# EAGLE design SSv3_outputAmp (EAGLE 7.7.0)
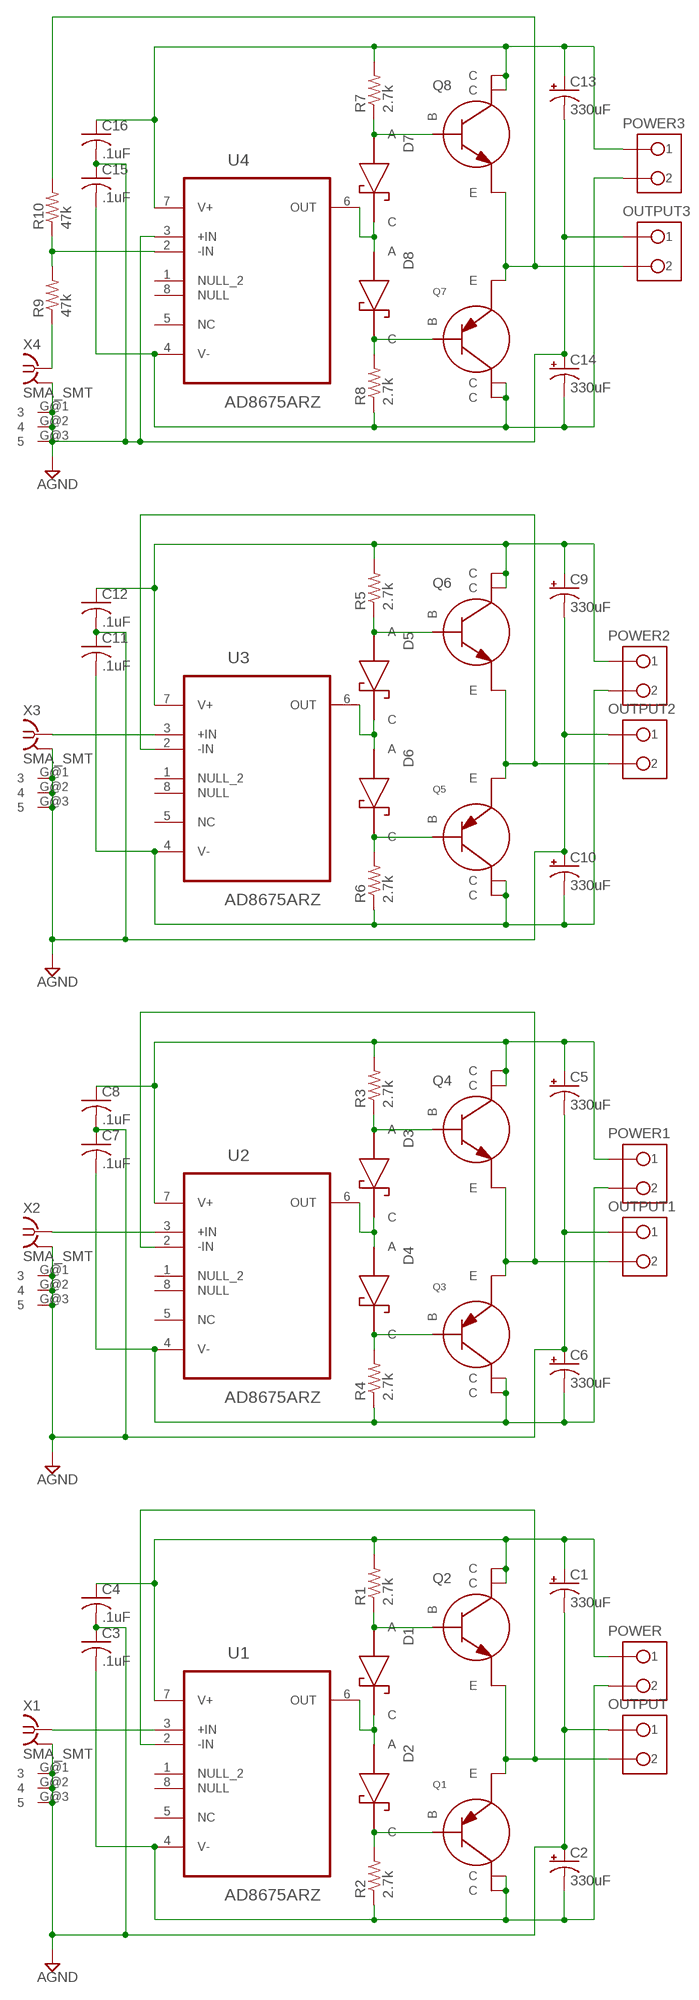
[diagram p0: schematic, sheet 1]

## Parts
C1  330uF  CPOL-USE3.5-8  [E3,5-8]
C2  330uF  CPOL-USE3.5-8  [E3,5-8]
C3  .1uF  C-USC0603  [C0603]
C4  .1uF  C-USC0603  [C0603]
C5  330uF  CPOL-USE3.5-8  [E3,5-8]
C6  330uF  CPOL-USE3.5-8  [E3,5-8]
C7  .1uF  C-USC0603  [C0603]
C8  .1uF  C-USC0603  [C0603]
C9  330uF  CPOL-USE3.5-8  [E3,5-8]
C10  330uF  CPOL-USE3.5-8  [E3,5-8]
C11  .1uF  C-USC0603  [C0603]
C12  .1uF  C-USC0603  [C0603]
C13  330uF  CPOL-USE3.5-8  [E3,5-8]
C14  330uF  CPOL-USE3.5-8  [E3,5-8]
C15  .1uF  C-USC0603  [C0603]
C16  .1uF  C-USC0603  [C0603]
D1  1N5819SOD123  [SOD-123]
D2  1N5819SOD123  [SOD-123]
D3  1N5819SOD123  [SOD-123]
D4  1N5819SOD123  [SOD-123]
D5  1N5819SOD123  [SOD-123]
D6  1N5819SOD123  [SOD-123]
D7  1N5819SOD123  [SOD-123]
D8  1N5819SOD123  [SOD-123]
OUTPUT  OST-2P-SCREW-TERMINAL  [OST-2P-SCREW-TERMINAL]
OUTPUT1  OST-2P-SCREW-TERMINAL  [OST-2P-SCREW-TERMINAL]
OUTPUT2  OST-2P-SCREW-TERMINAL  [OST-2P-SCREW-TERMINAL]
OUTPUT3  OST-2P-SCREW-TERMINAL  [OST-2P-SCREW-TERMINAL]
POWER  OST-2P-SCREW-TERMINAL  [OST-2P-SCREW-TERMINAL]
POWER1  OST-2P-SCREW-TERMINAL  [OST-2P-SCREW-TERMINAL]
POWER2  OST-2P-SCREW-TERMINAL  [OST-2P-SCREW-TERMINAL]
POWER3  OST-2P-SCREW-TERMINAL  [OST-2P-SCREW-TERMINAL]
Q1  NJT4030PSOT-223  [SOT223]
Q2  NJT4031NSOT-223  [SOT223]
Q3  NJT4030PSOT-223  [SOT223]
Q4  NJT4031NSOT-223  [SOT223]
Q5  NJT4030PSOT-223  [SOT223]
Q6  NJT4031NSOT-223  [SOT223]
Q7  NJT4030PSOT-223  [SOT223]
Q8  NJT4031NSOT-223  [SOT223]
R1  2.7k  R-US_R0603  [R0603]
R2  2.7k  R-US_R0603  [R0603]
R3  2.7k  R-US_R0603  [R0603]
R4  2.7k  R-US_R0603  [R0603]
R5  2.7k  R-US_R0603  [R0603]
R6  2.7k  R-US_R0603  [R0603]
R7  2.7k  R-US_R0603  [R0603]
R8  2.7k  R-US_R0603  [R0603]
R9  47k  R-US_R0603  [R0603]
R10  47k  R-US_R0603  [R0603]
U1  AD8675ARZ  [SOIC127P600X175-8N]
U2  AD8675ARZ  [SOIC127P600X175-8N]
U3  AD8675ARZ  [SOIC127P600X175-8N]
U4  AD8675ARZ  [SOIC127P600X175-8N]
X1  SMA_SMT  [SIDE_MOUNTSMA]
X2  SMA_SMT  [SIDE_MOUNTSMA]
X3  SMA_SMT  [SIDE_MOUNTSMA]
X4  SMA_SMT  [SIDE_MOUNTSMA]

## Nets
+12V: C1.+ C4.1 C5.+ C8.1 C9.+ C12.1 C13.+ C16.1 POWER1.P$1 POWER2.P$1 POWER3.P$1 POWER.P$1 Q2.2(C) Q2.4(C) Q4.2(C) Q4.4(C) Q6.2(C) Q6.4(C) Q8.2(C) Q8.4(C) R1.2 R3.2 R5.2 R7.2 U1.7(V+) U2.7(V+) U3.7(V+) U4.7(V+)
-12V: C2.- C3.2 C6.- C7.2 C10.- C11.2 C14.- C15.2 POWER1.P$2 POWER2.P$2 POWER3.P$2 POWER.P$2 Q1.2(C) Q1.4(C) Q3.2(C) Q3.4(C) Q5.2(C) Q5.4(C) Q7.2(C) Q7.4(C) R2.1 R4.1 R6.1 R8.1 U1.4(V-) U2.4(V-) U3.4(V-) U4.4(V-)
AGND: C1.- C2.+ C3.1 C4.2 C5.- C6.+ C7.1 C8.2 C9.- C10.+ C11.1 C12.2 C13.- C14.+ C15.1 C16.2 OUTPUT1.P$1 OUTPUT2.P$1 OUTPUT3.P$1 OUTPUT.P$1 U4.3(+IN) X1.G@1 X1.G@2 X1.G@3 X1.G@4 X2.G@1 X2.G@2 X2.G@3 X2.G@4 X3.G@1 X3.G@2 X3.G@3 X3.G@4 X4.G@1 X4.G@2 X4.G@3 X4.G@4
N$1: D1.C D2.A U1.6(OUT)
N$2: D1.A Q2.1(B) R1.1
N$3: D2.C Q1.1(B) R2.2
N$4: D3.C D4.A U2.6(OUT)
N$5: D3.A Q4.1(B) R3.1
N$6: D4.C Q3.1(B) R4.2
N$7: U1.3(+IN) X1.1
N$8: U2.3(+IN) X2.1
N$9: D5.C D6.A U3.6(OUT)
N$10: D5.A Q6.1(B) R5.1
N$11: D6.C Q5.1(B) R6.2
N$12: U3.3(+IN) X3.1
N$13: D7.C D8.A U4.6(OUT)
N$14: D7.A Q8.1(B) R7.1
N$15: D8.C Q7.1(B) R8.2
N$16: R9.1 X4.1
N$18: R9.2 R10.1 U4.2(-IN)
VOUT: OUTPUT.P$2 Q1.3(E) Q2.3(E) U1.2(-IN)
VOUT1: OUTPUT1.P$2 Q3.3(E) Q4.3(E) U2.2(-IN)
VOUT2: OUTPUT2.P$2 Q5.3(E) Q6.3(E) U3.2(-IN)
VOUT3: OUTPUT3.P$2 Q7.3(E) Q8.3(E) R10.2
Unconnected: U1.1(NULL_2) U1.5(NC) U1.8(NULL) U2.1(NULL_2) U2.5(NC) U2.8(NULL) U3.1(NULL_2) U3.5(NC) U3.8(NULL) U4.1(NULL_2) U4.5(NC) U4.8(NULL)

## Library data of the parts
C1 C2 C5 C6 C9 C10 C13 C14 = rcl:CPOL-US: POLARIZED CAPACITOR, American symbol
C3 C4 C7 C8 C11 C12 C15 C16 = rcl:C-US: CAPACITOR, American symbol
D1-D8 = SSv3_1:1N5819
OUTPUT OUTPUT1-OUTPUT3 POWER POWER1-POWER3 = SSv3_1:OST-2P-SCREW-TERMINAL
Q1 Q3 Q5 Q7 = SSv3_1:NJT4030P
Q2 Q4 Q6 Q8 = SSv3_1:NJT4031N
R1-R10 = resistor:R-US_: RESISTOR, American symbol
U1-U4 = Analog Devices_By_element14_Batch_1:AD8675ARZ: Rail-to-Rail Output Op Amp; MPN: AD8675ARZ; OC_FARNELL: 1389164; OC_NEWARK: 84K9788; PACKAGE: SOIC-8; SUPPLIER: Analog Devices
X1-X4 = SSv3_1:SMA_SMT: SMA 50 Ohm End Launch Jack Receptacle - Round Contact

## Board
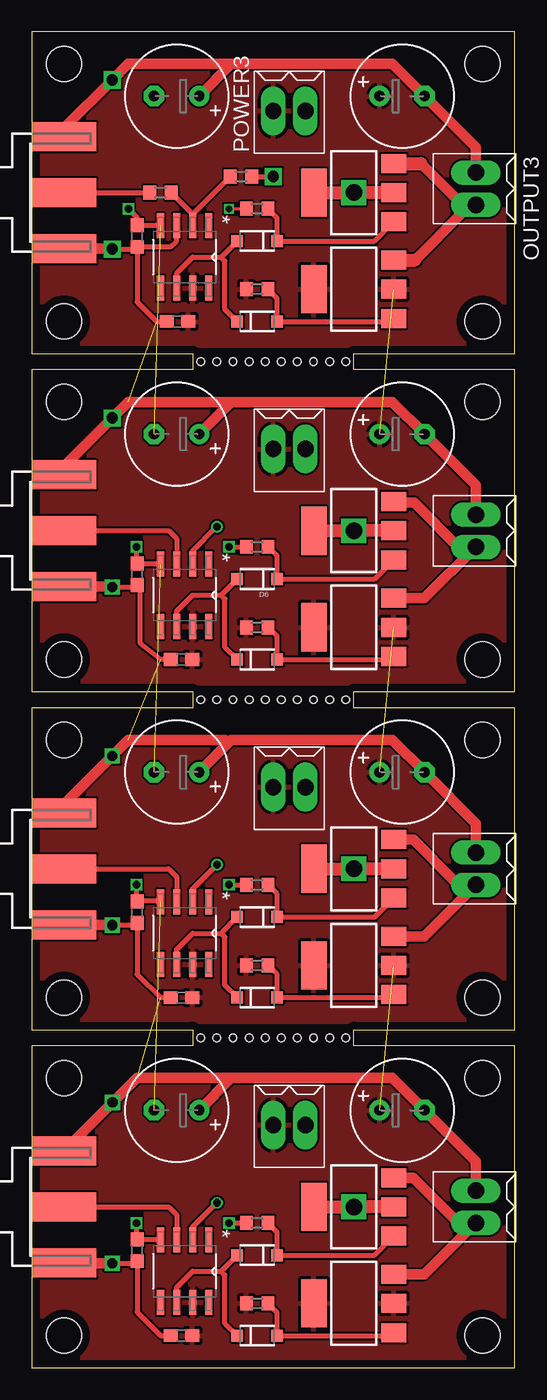
[diagram p1: board, top side]
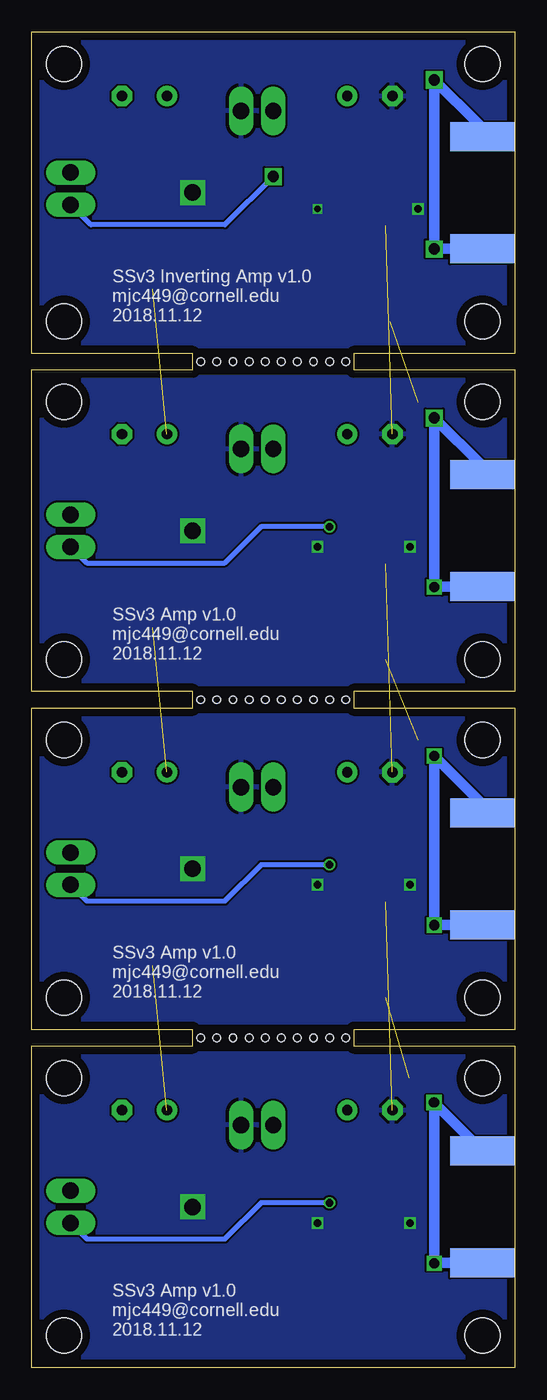
[diagram p2: board, bottom side, seen from below]

Size 38.1 x 105.41 mm. Coordinates in mm from the lower left corner, seen from the top.
Outline: 0,0 38.1,0 38.1,25.4 25.4,25.4 25.4,26.67 38.1,26.67 38.1,52.07 25.4,52.07 25.4,53.34 38.1,53.34 38.1,78.74 25.4,78.74 25.4,80.01 38.1,80.01 38.1,105.41 0,105.41 0,80.01 12.7,80.01 12.7,78.74 0,78.74 0,53.34 12.7,53.34 12.7,52.07 0,52.07 0,26.67 12.7,26.67 12.7,25.4 0,25.4 0,0
Copper layers (1*16): Top 0.035559375mm / dielectric 1.6mm / Bottom 0.035559375mm
Design rules "oshpark-2layer *": minimum track width 6mil, minimum drill 10mil, track to track 6mil, track to pad 6mil, pad to pad 6mil, via to via 6mil, smd to smd 6mil, copper to edge 25mil, drill to drill 6mil, minimum pad ring 5mil, minimum via ring 5mil, stop-mask expansion 2.5mil, vias tented up to drill 0mil, thermal gap 10mil
Holes 2.8 mm at 2.54,22.86 35.56,22.86 35.56,2.54 2.54,2.54 2.54,49.53 35.56,49.53 35.56,29.21 2.54,29.21 2.54,76.2 35.56,76.2 35.56,55.88 2.54,55.88 2.54,102.87 35.56,102.87 35.56,82.55 2.54,82.55
Holes 0.6 mm at 14.61,26.04 17.14,26.04 19.68,26.04 22.23,26.04 23.5,26.04 20.95,26.04 18.41,26.04 15.88,26.04 14.61,52.7 15.88,52.7 17.14,52.7 18.41,52.7 19.68,52.7 20.95,52.7 22.23,52.7 23.5,52.7 14.61,79.38 15.88,79.38 17.14,79.38 18.41,79.38 19.68,79.38 20.95,79.38 22.23,79.38 23.5,79.38 13.34,79.38 24.77,79.38 24.77,52.7 13.34,52.7 24.77,26.04 13.34,26.04
tRestrict: area 0,25.4 to 38.1,26.7; area 0,52.1 to 38.1,53.3; area 0,78.7 to 38.1,80
bRestrict: area 0,25.4 to 38.1,26.7; area 0,52.1 to 38.1,53.3; area 0,78.7 to 38.1,80

### Footprints (pad centres in the part's own frame; a part is rotated, then mirrored left to right if it is on the bottom)
E3,5-8 = drill 0.813 pad 1.6: + -1.778,0 | drill 0.813 pad 1.6 octagon: - 1.778,0
C0603 = smd 1.1 x 1: 1 -0.85,0; 2 0.85,0
SOD-123 = smd 0.9 x 0.95: A 1.575,0; C -1.575,0
OST-2P-SCREW-TERMINAL = drill 1.3 long: P$1 -1.27,0.1; P$2 1.27,0.1
SOT223 = smd 1.5 x 2: 1 -2.3,-3.15; 2 0,-3.15; 3 2.3,-3.15 | smd 3.8 x 2: 4 0,3.15
R0603 = smd 1 x 1.1: 1 -0.85,0; 2 0.85,0
SOIC127P600X175-8N = smd 1.981 x 0.559: 1 -2.464,1.905; 2 -2.464,0.635; 3 -2.464,-0.635; 4 -2.464,-1.905; 5 2.464,-1.905; 6 2.464,-0.635; 7 2.464,0.635; 8 2.464,1.905
SIDE_MOUNTSMA = smd 5.08 x 2.286: 1 2.565,0; G@1 2.565,4.42; G@2 2.565,-4.42 | smd 5.08 x 2.286 bottom: G@3 2.565,4.42; G@4 2.565,-4.42

### Placement (x,y rotation side)
C1  29.21,20.32 0 top
C2  11.43,20.32 180 top
C3  8.32,9.27 90 top
C4  11.81,2.54 180 top
C5  29.21,46.99 0 top
C6  11.43,46.99 180 top
C7  8.32,35.94 90 top
C8  11.81,29.21 180 top
C9  29.21,73.66 0 top
C10  11.43,73.66 180 top
C11  8.32,62.61 90 top
C12  11.81,55.88 180 top
C13  29.21,100.33 0 top
C14  11.43,100.33 180 top
C15  8.32,89.28 90 top
C16  11.49,82.55 180 top
D1  17.78,2.54 0 top
D2  17.78,8.89 180 top
D3  17.78,29.21 0 top
D4  17.78,35.56 180 top
D5  17.78,55.88 0 top
D6  17.78,62.23 180 top
D7  17.78,82.55 0 top
D8  17.78,88.9 180 top
OUTPUT  34.92,12.7 270 top
OUTPUT1  34.92,39.37 270 top
OUTPUT2  34.92,66.04 270 top
OUTPUT3  34.92,93.03 270 top
POWER  20.32,19.05 0 top
POWER1  20.32,45.72 0 top
POWER2  20.32,72.39 0 top
POWER3  20.32,99.06 0 top
Q1  25.4,12.7 90 top
Q2  25.4,5.08 90 top
Q3  25.4,39.37 90 top
Q4  25.4,31.75 90 top
Q5  25.4,66.04 90 top
Q6  25.4,58.42 90 top
Q7  25.4,92.71 90 top
Q8  25.4,85.09 90 top
R1  17.78,5.08 180 top
R2  17.78,11.43 0 top
R3  17.78,31.75 180 top
R4  17.78,38.1 0 top
R5  17.78,58.42 180 top
R6  17.78,64.77 0 top
R7  17.78,85.09 180 top
R8  17.78,91.44 0 top
R9  10.16,92.71 0 top
R10  16.51,93.98 0 top
U1  12.06,7.62 270 top
U2  12.06,34.29 270 top
U3  12.06,60.96 270 top
U4  12.06,87.63 270 top
X1  0,12.7 0 top
X2  0,39.37 0 top
X3  0,66.04 0 top
X4  0,92.71 0 top

### Tracks (layer width: path | path; a pad name or v marks a point on that pad's centre or on a via)
+12V  (3 unrouted)
  pour Top: 0,24.77 38.1,24.77 38.1,0 0,0
  pour Top: 0,51.44 38.1,51.44 38.1,27.3 0,27.3
  pour Top: 0,78.11 38.1,78.11 38.1,53.98 0,53.98
  pour Top: 0,105.41 38.1,105.41 38.1,80.64 0,80.64
-12V  (via drill 0.5, 0.6, 1.3)  (3 unrouted)
  Top 0.254: v15.56,91.44 R8.1
  Top 0.406: v15.56,38.1 R4.1 | v15.56,64.77 R6.1 | v7.62,91.44 8.32,90.74 C15.2 10.12,90.13 U4.4 | U3.4 8.36,63.42 C11.2 8.26,63.52 v8.26,64.77 | v8.26,38.1 8.26,36.85 C7.2 8.57,36.85 10.06,36.85 U2.4 | v8.26,11.43 8.26,10.18 C3.2 10.12,10.12 U1.4 | v15.56,11.43 R2.1
  Top 1.016: Q1.4 v25.4,12.7 Q1.2 | Q7.4 v25.4,92.71 Q7.2 | Q5.4 v25.4,66.04 Q5.2 | Q3.4 v25.4,39.37 Q3.2
  pour Bottom: 0,24.77 38.1,24.77 38.1,0 0,0
  pour Bottom: 0,51.44 38.1,51.44 38.1,27.3 0,27.3
  pour Bottom: 0,78.11 38.1,78.11 38.1,53.98 0,53.98
  pour Bottom: 0,105.41 38.1,105.41 38.1,80.64 0,80.64
AGND  (via drill 0.8, 0.9)  (3 unrouted)
  Top 0.406: v6.35,8.26 8.47,8.26 C3.1 8.32,4.38 10.16,2.54 C4.2 | C8.2 10.16,29.21 8.32,31.05 C7.1 8.47,34.92 v6.35,34.92 | C12.2 10.16,55.88 8.57,57.15 8.57,61.51 C11.1 8.47,61.59 v6.35,61.59 | v6.35,88.27 8.15,88.27 C15.1 | C15.1 8.32,84.07 9.84,82.55 C16.2 | C15.1 10.96,88.43 11.43,88.9 U4.3
  Top 0.813: C2.+ 15.75,22.86 | 15.75,22.86 28.45,22.86 C1.- 35.02,16.28 OUTPUT.P$1 | C6.+ 15.49,49.28 | 15.49,49.28 15.75,49.53 28.45,49.53 C5.- 35.02,42.95 OUTPUT1.P$1 | C10.+ 15.75,76.2 | 15.75,76.2 28.45,76.2 C9.- 35.02,69.62 OUTPUT2.P$1 | C14.+ 15.75,102.87 | 15.75,102.87 28.45,102.87 C13.- 35.02,96.29 OUTPUT3.P$1 | 15.75,22.86 8.31,22.86 v6.38,20.93 X1.G@1 | v6.35,8.26 2.59,8.26 X1.G@2 | X2.G@1 2.56,44.48 v6.35,48.26 7.62,49.53 15.24,49.53 15.49,49.28 | X2.G@2 6.33,34.95 v6.35,34.92 | X3.G@1 2.56,71.14 v6.35,74.93 7.62,76.2 15.75,76.2 | X3.G@2 6.33,61.62 v6.35,61.59 | X4.G@2 6.33,88.29 v6.35,88.27 | X4.G@1 2.54,97.16 2.54,97.79 v6.35,101.6 7.62,102.87 15.75,102.87
  Bottom 0.813: X1.G@2 6.33,8.28 v6.35,8.26 6.35,20.9 v6.38,20.93 X1.G@1 | X2.G@1 2.56,44.48 v6.35,48.26 v6.35,34.92 2.59,34.92 X2.G@2 | X3.G@1 2.54,70.48 2.54,71.12 v6.35,74.93 v6.35,61.59 6.33,61.62 X3.G@2 | X4.G@2 6.33,88.29 v6.35,88.27 v6.35,101.6 2.86,98.11 2.86,97.42 X4.G@1
N$1
  Top 0.406: U1.6 11.43,6.35 12.7,7.62 14.94,7.62 | 14.94,7.62 D2.A | D1.C 16.19,2.54 15.24,3.49 15.24,7.32 14.94,7.62
N$2
  Top 0.406: R1.1 19.36,4.36 D1.A 28.31,2.54 Q2.1
N$3
  Top 0.406: Q1.1 27.04,8.89 D2.C 19.36,10.71 R2.2
N$4
  Top 0.406: U2.6 11.43,33.02 12.7,34.29 14.94,34.29 | 14.94,34.29 D4.A | D3.C 16.19,29.21 15.24,30.16 15.24,33.98 14.94,34.29
N$5
  Top 0.406: Q4.1 28.31,29.21 D3.A 19.36,31.02 R3.1
N$6
  Top 0.406: Q3.1 27.04,35.56 D4.C 19.36,37.38 R4.2
N$7
  Top 0.406: X1.1 10.79,12.7 11.43,12.06 U1.3
N$8
  Top 0.406: X2.1 10.79,39.37 11.43,38.73 U2.3
N$9
  Top 0.406: U3.6 11.43,59.69 12.7,60.96 14.94,60.96 | 14.94,60.96 D6.A | D5.C 16.19,55.88 15.24,56.83 15.24,60.66 14.94,60.96
N$10
  Top 0.406: Q6.1 28.31,55.88 D5.A 19.36,57.7 R5.1
N$11
  Top 0.406: Q5.1 27.04,62.23 D6.C 19.36,64.05 R6.2
N$12
  Top 0.406: X3.1 10.79,66.04 11.43,65.41 U3.3
N$13
  Top 0.406: U4.6 11.43,86.36 12.7,87.63 14.94,87.63 | 14.94,87.63 D8.A | D7.C 16.19,82.55 15.24,83.5 15.24,87.33 14.94,87.63
N$14
  Top 0.406: Q8.1 28.31,82.55 D7.A 19.36,84.36 R7.1
N$15
  Top 0.406: Q7.1 27.04,88.9 D8.C 19.36,90.72 R8.2
N$16
  Top 0.406: X4.1 R9.1
N$18
  Top 0.406: U4.2 12.7,91.02 | 12.7,91.02 R9.2 | R10.1 12.7,91.02
VOUT  (via drill 0.6)
  Top 0.406: U1.2 12.7,11.11 v14.61,13.02
  Top 0.813: Q1.3 30.09,15 33.66,11.43 OUTPUT.P$2 30.98,7.38 Q2.3
  Bottom 0.406: v14.61,13.02 20,13.02 22.86,10.16 33.76,10.16 OUTPUT.P$2
VOUT1  (via drill 0.6)
  Top 0.406: U2.2 12.7,37.78 v14.61,39.69
  Top 0.813: Q3.3 30.09,41.67 33.34,38.42 34.71,38.42 OUTPUT1.P$2 30.98,34.05 Q4.3
  Bottom 0.406: v14.61,39.69 20,39.69 22.86,36.83 33.76,36.83 OUTPUT1.P$2
VOUT2  (via drill 0.6)
  Top 0.406: U3.2 12.7,64.45 v14.61,66.36
  Top 0.813: Q5.3 28.63,68.26 30.16,68.26 33.66,64.77 OUTPUT2.P$2 30.98,60.72 Q6.3
  Bottom 0.406: v14.61,66.36 20,66.36 22.86,63.5 33.76,63.5 OUTPUT2.P$2
VOUT3  (via drill 0.9)
  Top 0.406: R10.2 v19.05,93.98
  Top 0.813: OUTPUT3.P$2 33.97,91.76 | 33.97,91.76 30.72,95.01 | 33.97,91.76 33.97,91.12 30.24,87.39
  Top 1.016: Q7.3 30.72,95.01 | Q8.3 30.24,87.39
  Bottom 0.406: v19.05,93.98 22.86,90.17 33.44,90.17 OUTPUT3.P$2

### Text on the board
bNames: SSv3 Inverting Amp v1.0 / mjc449@cornell.edu / 2018.11.12 | SSv3 Amp v1.0 / mjc449@cornell.edu / 2018.11.12 | SSv3 Amp v1.0 / mjc449@cornell.edu / 2018.11.12 | SSv3 Amp v1.0 / mjc449@cornell.edu / 2018.11.12
tValues: +12V | -12V | GND | Vout | +12V | -12V | GND | Vout | -12V | +12V | GND | Vout | +12V | -12V | GND | Vout